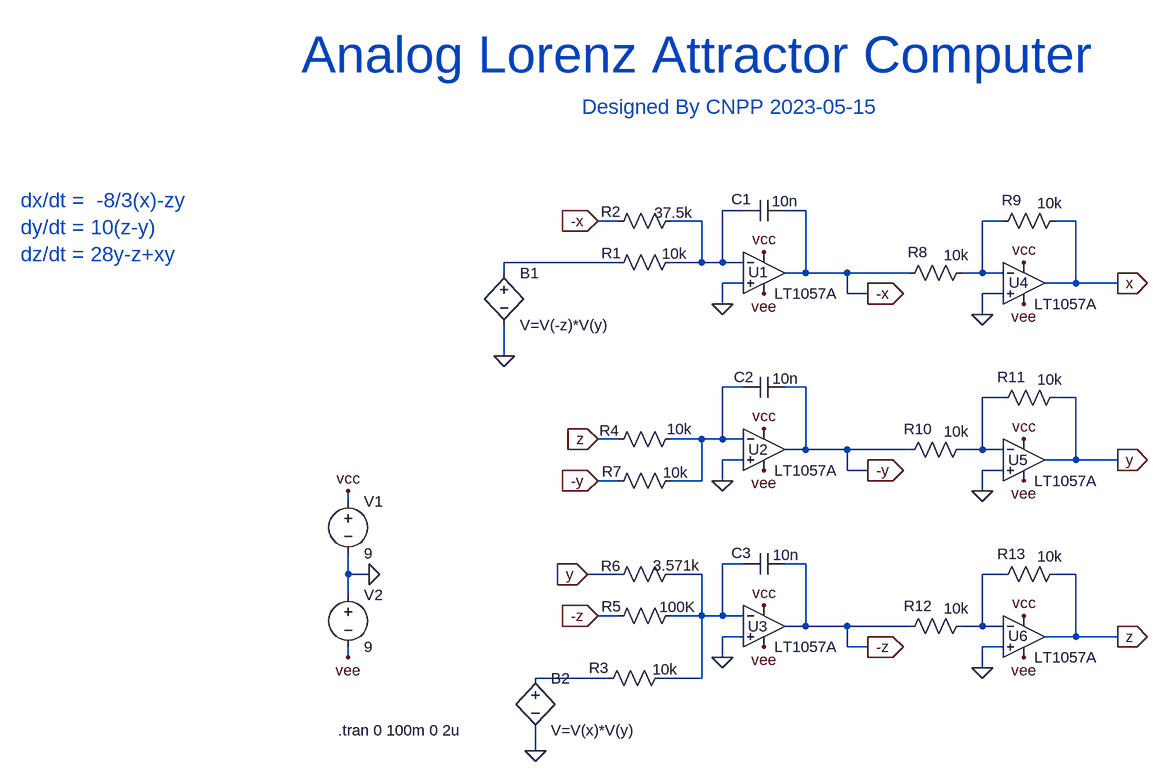
[diagram p0: schematic lorenz_var (3).asc]
lorenz_var (3).asc, the LTspice schematic file:
Version 4
SHEET 1 1536 968
WIRE 384 -48 352 -48
WIRE 480 -48 448 -48
WIRE 192 -32 160 -32
WIRE 320 -32 272 -32
WIRE 784 -32 752 -32
WIRE 896 -32 864 -32
WIRE 192 32 16 32
WIRE 320 32 320 -32
WIRE 320 32 272 32
WIRE 352 32 352 -48
WIRE 352 32 320 32
WIRE 384 32 352 32
WIRE 16 48 16 32
WIRE 480 48 480 -48
WIRE 480 48 448 48
WIRE 544 48 480 48
WIRE 640 48 544 48
WIRE 752 48 752 -32
WIRE 752 48 720 48
WIRE 784 48 752 48
WIRE 384 64 352 64
WIRE 896 64 896 -32
WIRE 896 64 848 64
WIRE 960 64 896 64
WIRE 544 80 544 48
WIRE 576 80 544 80
WIRE 784 80 752 80
WIRE 352 96 352 64
WIRE 752 112 752 80
WIRE 16 176 16 128
WIRE 384 224 352 224
WIRE 480 224 448 224
WIRE 784 240 752 240
WIRE 896 240 864 240
WIRE 192 304 160 304
WIRE 320 304 272 304
WIRE 352 304 352 224
WIRE 352 304 320 304
WIRE 384 304 352 304
WIRE 480 320 480 224
WIRE 480 320 448 320
WIRE 544 320 480 320
WIRE 640 320 544 320
WIRE 752 320 752 240
WIRE 752 320 720 320
WIRE 784 320 752 320
WIRE 384 336 352 336
WIRE 896 336 896 240
WIRE 896 336 848 336
WIRE 960 336 896 336
WIRE 544 352 544 320
WIRE 576 352 544 352
WIRE 784 352 752 352
WIRE 192 368 160 368
WIRE 320 368 320 304
WIRE 320 368 272 368
WIRE 352 368 352 336
WIRE 752 384 752 352
WIRE -224 400 -224 384
WIRE 384 496 352 496
WIRE 480 496 448 496
WIRE -224 512 -224 480
WIRE -192 512 -224 512
WIRE 192 512 144 512
WIRE 320 512 272 512
WIRE 784 512 752 512
WIRE 896 512 864 512
WIRE -224 544 -224 512
WIRE 192 576 160 576
WIRE 320 576 320 512
WIRE 320 576 272 576
WIRE 352 576 352 496
WIRE 352 576 320 576
WIRE 384 576 352 576
WIRE 480 592 480 496
WIRE 480 592 448 592
WIRE 544 592 480 592
WIRE 640 592 544 592
WIRE 752 592 752 512
WIRE 752 592 720 592
WIRE 784 592 752 592
WIRE 384 608 352 608
WIRE 896 608 896 512
WIRE 896 608 848 608
WIRE 960 608 896 608
WIRE 544 624 544 592
WIRE 576 624 544 624
WIRE 784 624 752 624
WIRE -224 640 -224 624
WIRE 352 640 352 608
WIRE 752 656 752 624
WIRE 176 672 64 672
WIRE 320 672 320 576
WIRE 320 672 256 672
WIRE 64 784 64 752
FLAG -192 512 0
FLAG -224 384 vcc
FLAG -224 640 vee
FLAG 416 80 vee
FLAG 416 16 vcc
FLAG 352 96 0
FLAG 416 352 vee
FLAG 416 288 vcc
FLAG 352 368 0
FLAG 416 624 vee
FLAG 416 560 vcc
FLAG 352 640 0
FLAG 576 80 -x
IOPIN 576 80 Out
FLAG 576 352 -y
IOPIN 576 352 Out
FLAG 576 624 -z
IOPIN 576 624 Out
FLAG 816 96 vee
FLAG 816 32 vcc
FLAG 752 112 0
FLAG 960 64 x
IOPIN 960 64 Out
FLAG 816 368 vee
FLAG 816 304 vcc
FLAG 752 384 0
FLAG 960 336 y
IOPIN 960 336 Out
FLAG 816 640 vee
FLAG 816 576 vcc
FLAG 752 656 0
FLAG 960 608 z
IOPIN 960 608 Out
FLAG 160 -32 -x
IOPIN 160 -32 In
FLAG 160 304 z
IOPIN 160 304 In
FLAG 160 368 -y
IOPIN 160 368 In
FLAG 160 576 -z
IOPIN 160 576 In
FLAG 144 512 y
IOPIN 144 512 In
FLAG 16 176 0
FLAG 64 784 0
SYMBOL voltage -224 384 R0
WINDOW 123 0 0 Left 0
WINDOW 39 0 0 Left 0
SYMATTR InstName V1
SYMATTR Value 9
SYMBOL voltage -224 528 R0
WINDOW 123 0 0 Left 0
WINDOW 39 0 0 Left 0
SYMATTR InstName V2
SYMATTR Value 9
SYMBOL cap 448 -64 R90
WINDOW 0 14 67 VBottom 2
WINDOW 3 -14 0 VTop 2
SYMATTR InstName C1
SYMATTR Value 10n
SYMATTR Value2 IC=0.2V
SYMBOL res 288 16 R90
WINDOW 0 17 107 VBottom 2
WINDOW 3 -13 10 VTop 2
SYMATTR InstName R1
SYMATTR Value 10k
SYMBOL res 288 -48 R90
WINDOW 0 17 108 VBottom 2
WINDOW 3 -12 11 VTop 2
SYMATTR InstName R2
SYMATTR Value 37.5k
SYMBOL cap 448 208 R90
WINDOW 0 16 63 VBottom 2
WINDOW 3 -13 -1 VTop 2
SYMATTR InstName C2
SYMATTR Value 10n
SYMATTR Value2 IC=0.2V
SYMBOL res 272 656 R90
WINDOW 0 16 110 VBottom 2
WINDOW 3 -13 8 VTop 2
SYMATTR InstName R3
SYMATTR Value 10k
SYMBOL res 288 288 R90
WINDOW 0 18 110 VBottom 2
WINDOW 3 -15 2 VTop 2
SYMATTR InstName R4
SYMATTR Value 10k
SYMBOL cap 448 480 R90
WINDOW 0 15 67 VBottom 2
WINDOW 3 -13 -2 VTop 2
SYMATTR InstName C3
SYMATTR Value 10n
SYMATTR Value2 IC=0.2V
SYMBOL res 288 560 R90
WINDOW 0 17 107 VBottom 2
WINDOW 3 -13 5 VTop 2
SYMATTR InstName R5
SYMATTR Value 100K
SYMBOL res 288 496 R90
WINDOW 0 19 108 VBottom 2
WINDOW 3 -13 7 VTop 2
SYMATTR InstName R6
SYMATTR Value 3.571k
SYMBOL res 288 352 R90
WINDOW 0 17 106 VBottom 2
WINDOW 3 -12 8 VTop 2
SYMATTR InstName R7
SYMATTR Value 10k
SYMBOL Opamps\\LT1057A 416 -16 R0
WINDOW 0 -24 63 Left 2
SYMATTR InstName U1
SYMBOL Opamps\\LT1057A 416 256 R0
WINDOW 0 -24 64 Left 2
SYMATTR InstName U2
SYMBOL Opamps\\LT1057A 416 528 R0
WINDOW 0 -25 64 Left 2
SYMATTR InstName U3
SYMBOL Opamps\\LT1057A 816 0 R0
WINDOW 0 -23 63 Left 2
SYMATTR InstName U4
SYMBOL res 736 32 R90
WINDOW 0 0 83 VBottom 2
WINDOW 3 -27 24 VTop 2
SYMATTR InstName R8
SYMATTR Value 10k
SYMBOL res 880 -48 R90
WINDOW 0 0 83 VBottom 2
WINDOW 3 -27 24 VTop 2
SYMATTR InstName R9
SYMATTR Value 10k
SYMBOL Opamps\\LT1057A 816 272 R0
WINDOW 0 -24 64 Left 2
SYMATTR InstName U5
SYMBOL res 736 304 R90
WINDOW 0 0 83 VBottom 2
WINDOW 3 -27 24 VTop 2
SYMATTR InstName R10
SYMATTR Value 10k
SYMBOL res 880 224 R90
WINDOW 0 0 83 VBottom 2
WINDOW 3 -27 24 VTop 2
SYMATTR InstName R11
SYMATTR Value 10k
SYMBOL Opamps\\LT1057A 816 544 R0
WINDOW 0 -24 63 Left 2
SYMATTR InstName U6
SYMBOL res 736 576 R90
WINDOW 0 0 83 VBottom 2
WINDOW 3 -27 24 VTop 2
SYMATTR InstName R12
SYMATTR Value 10k
SYMBOL res 880 496 R90
WINDOW 0 0 83 VBottom 2
WINDOW 3 -27 24 VTop 2
SYMATTR InstName R13
SYMATTR Value 10k
SYMBOL bv 16 32 R0
SYMATTR InstName B1
SYMATTR Value V=V(-z)*V(y)
SYMBOL bv 64 656 R0
SYMATTR InstName B2
SYMATTR Value V=V(x)*V(y)
TEXT -240 752 Left 2 !.tran 0 100m 0 2u
TEXT -296 -288 Left 6 ;Analog Lorenz Attractor Computer
TEXT -728 -64 Left 3 ;dx/dt =  -8/3(x)-zy\ndy/dt = 10(z-y)\ndz/dt = 28y-z+xy
TEXT 136 -208 Left 3 ;Designed By CNPP 2023-05-15

The netlist it stands for:
* lorenz_var (3).asc
V1 vcc 0 9
V2 0 vee 9
C1 -x N001 10n IC=0.2V
R1 N001 N003 10k
R2 N001 -x 37.5k
C2 -y N004 10n IC=0.2V
R3 N006 N008 10k
R4 N004 z 10k
C3 -z N006 10n IC=0.2V
R5 N006 -z 100K
R6 N006 y 3.571k
R7 N004 -y 10k
XU1 0 N001 vcc vee -x LT1057A  ; pins In+ In- V+ V- OUT
XU2 0 N004 vcc vee -y LT1057A  ; pins In+ In- V+ V- OUT
XU3 0 N006 vcc vee -z LT1057A  ; pins In+ In- V+ V- OUT
XU4 0 N002 vcc vee x LT1057A  ; pins In+ In- V+ V- OUT
R8 N002 -x 10k
R9 x N002 10k
XU5 0 N005 vcc vee y LT1057A  ; pins In+ In- V+ V- OUT
R10 N005 -y 10k
R11 y N005 10k
XU6 0 N007 vcc vee z LT1057A  ; pins In+ In- V+ V- OUT
R12 N007 -z 10k
R13 z N007 10k
B1 N003 0 V=V(-z)*V(y)
B2 N008 0 V=V(x)*V(y)
.tran 0 100m 0 2u
* Analog Lorenz Attractor Computer
* dx/dt =  -8/3(x)-zy
* dy/dt = 10(z-y)
* dz/dt = 28y-z+xy
* Designed By CNPP 2023-05-15
.backanno
.end